# Altium schematic sheet E1811HUB_1.SchDoc
size C
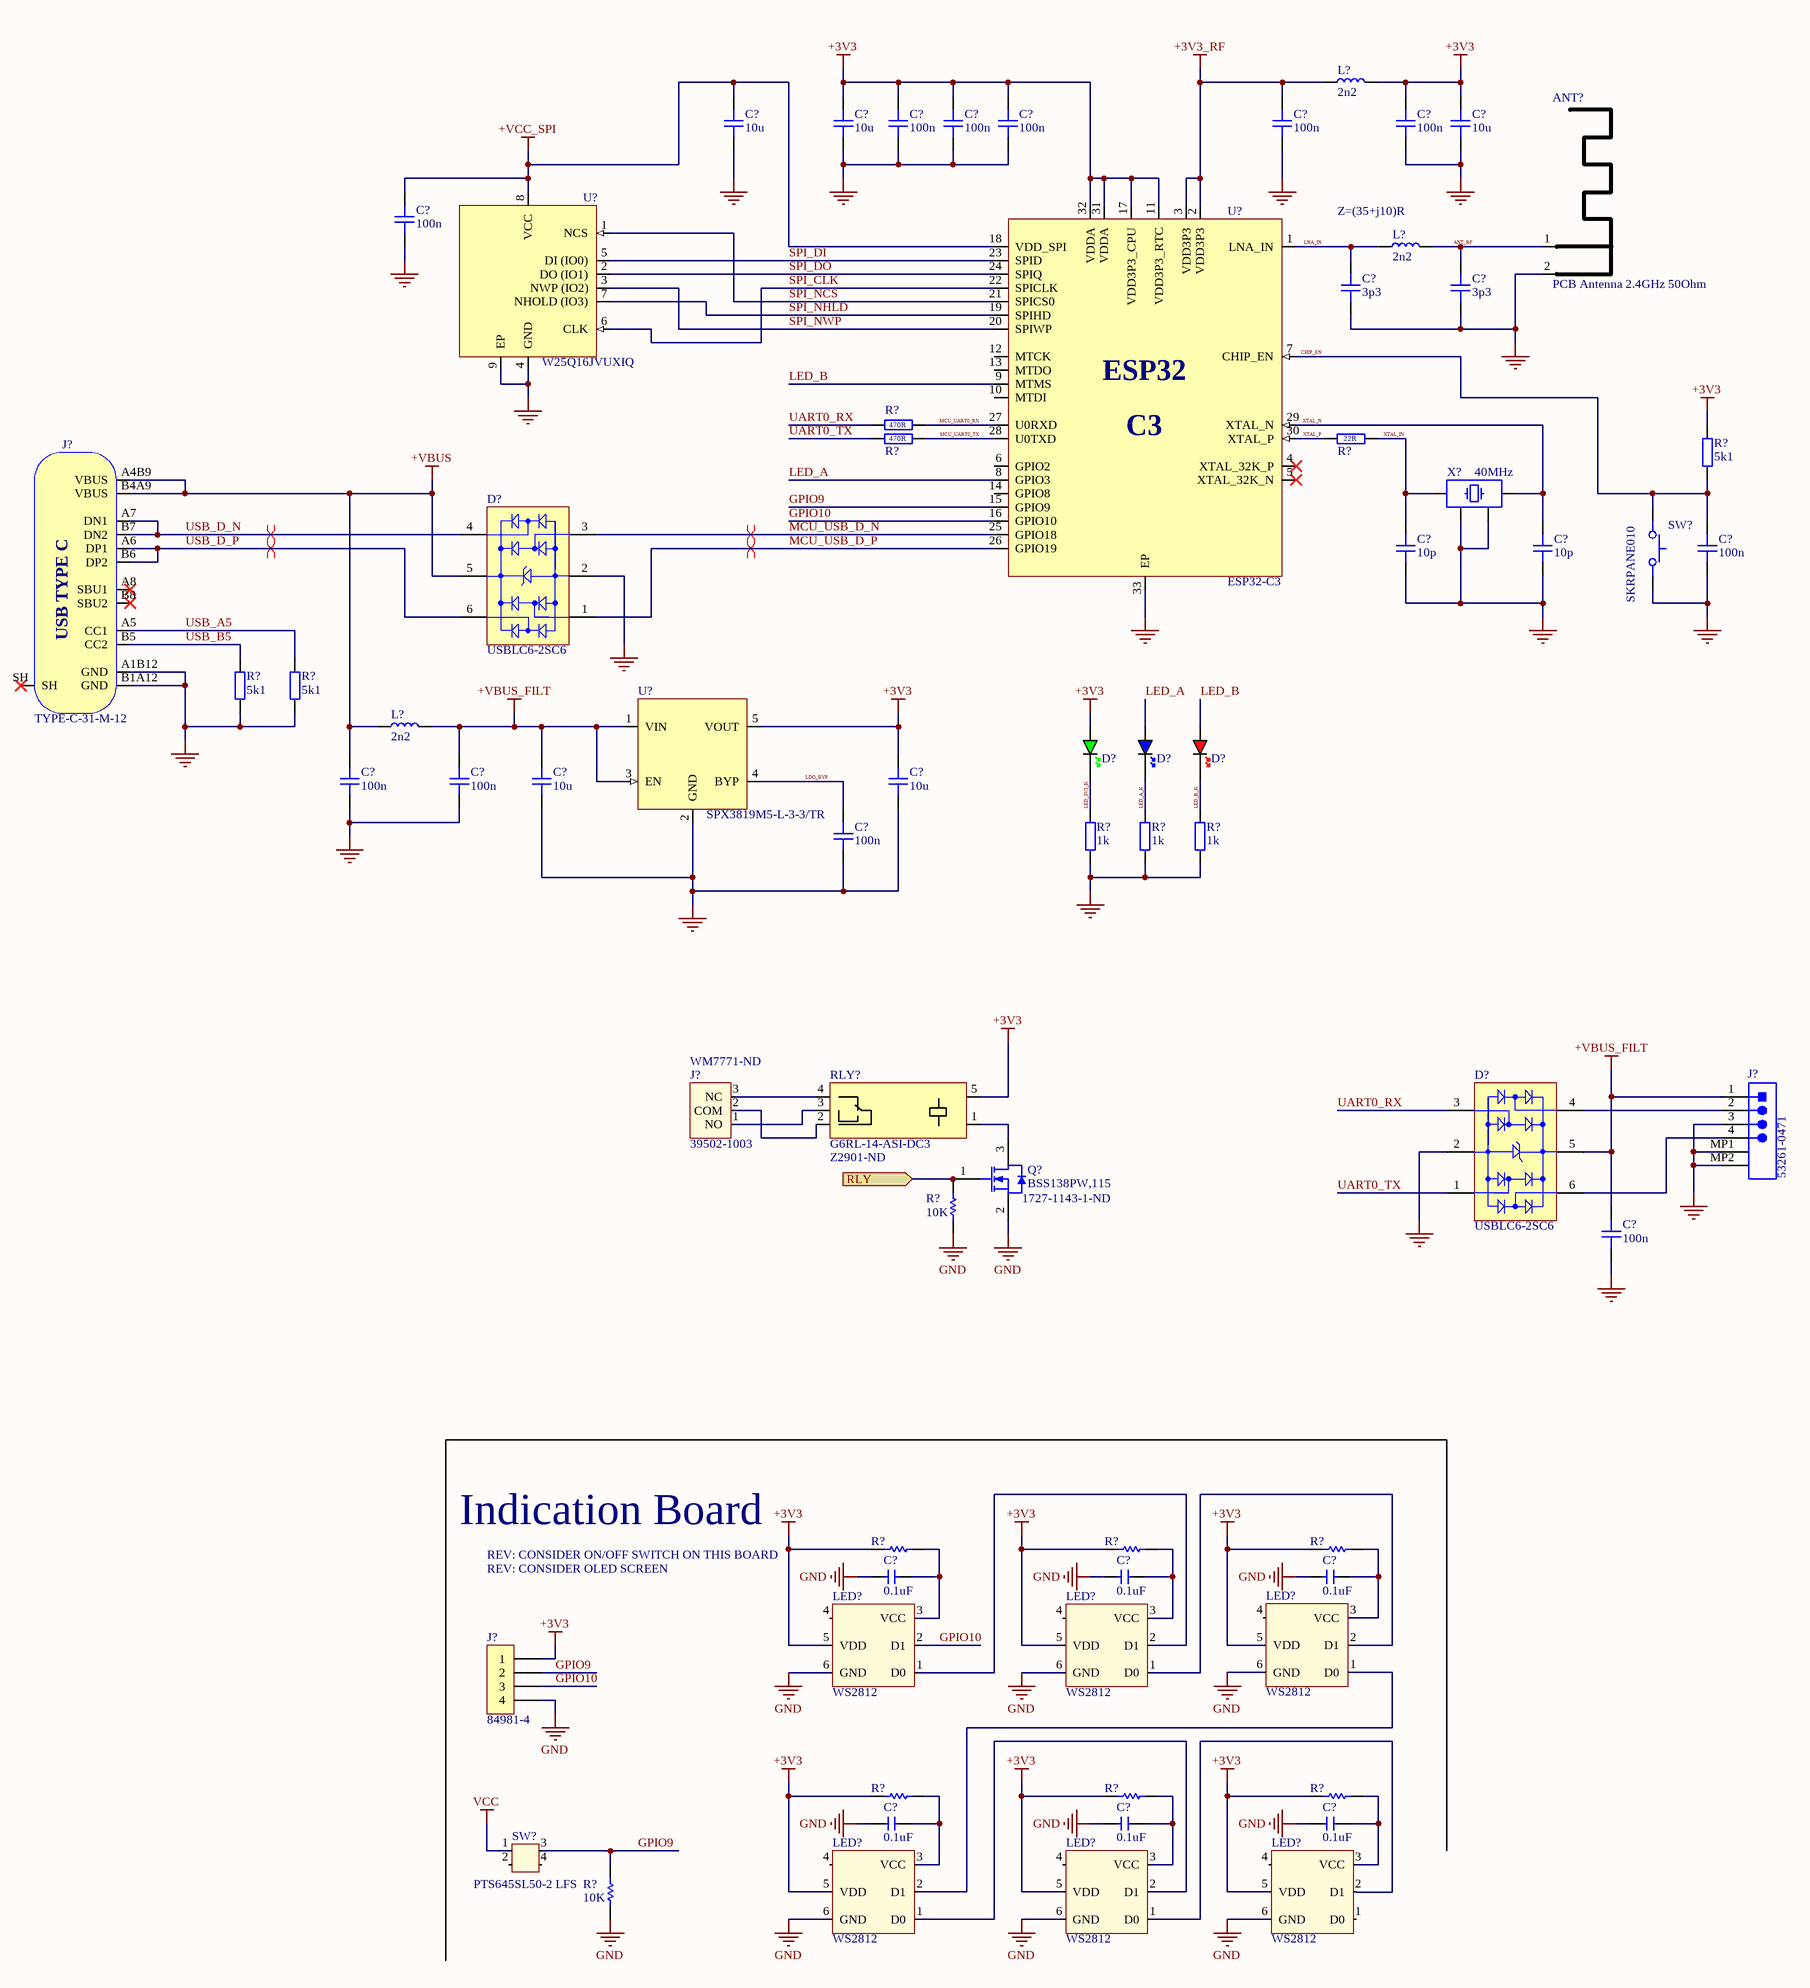
[diagram p0: E1811HUB_1.SchDoc]

## Parts
(Parts that share a designator on the sheet are numbered #1, #2 ... from top to bottom, then left to right.)
ANT?  PCB Antenna 2.4GHz 50Ohm  [ANT_IFA_USB_2_4GHZ_50R]  (no BOM)
C?#1  10u  [CAP_0603]
C?#2  10u  [CAP_0603]
C?#3  100n  [CAP_0402]
C?#4  100n  [CAP_0402]
C?#5  100n  [CAP_0402]
C?#6  100n  [CAP_0402]
C?#7  100n  [CAP_0402]
C?#8  10u  [CAP_0603]
C?#9  100n  [CAP_0402]
C?#10  3p3  [CAP_0402]
C?#11  3p3  [CAP_0402]
C?#12  10p  [CAP_0402]
C?#13  10p  [CAP_0402]
C?#14  100n  [CAP_0402]
C?#15  100n  [CAP_0402]
C?#16  100n  [CAP_0402]
C?#17  10u  [CAP_0603]
C?#18  10u  [CAP_0603]
C?#19  100n  [CAP_0402]
C?#20  100n  [CAP_0402]
C?#21  0.1uF  [CAPC2012N]
C?#22  0.1uF  [CAPC2012N]
C?#23  0.1uF  [CAPC2012N]
C?#24  0.1uF  [CAPC2012N]
C?#25  0.1uF  [CAPC2012N]
C?#26  0.1uF  [CAPC2012N]
D?#1  USBLC6-2SC6  [STM-SOT23-6L_V]
D?#2  GREEN  [LED_0603_GREEN]  (value not drawn)
D?#3  BLUE  [LED_0603_BLUE]  (value not drawn)
D?#4  RED  [LED_0603_RED]  (value not drawn)
D?#5  USBLC6-2SC6  [STM-SOT23-6L_V]
J?#1  TYPE-C-31-M-12  [TYPE-C-31-M-12]
J?#2  53261-0471  [MOLEX-53261-0471_V]
J?#3  39502-1003  Supplier Part Number 1: WM7771-ND  [39502-1003]
J?#4  84981-4  [84981-4]
L?#1  2n2  [IND_0402]
L?#2  2n2  [IND_0402]
L?#3  2n2  [IND_0402]
LED?#1  WS2812  [WS2812]
LED?#2  WS2812  [WS2812]
LED?#3  WS2812  [WS2812]
LED?#4  WS2812  [WS2812]
LED?#5  WS2812  [WS2812]
LED?#6  WS2812  [WS2812]
Q?  BSS138PW,115  Supplier Part Number 1: 1727-1143-1-ND  [NXP-SOT323_M]
R?#1  470R  [RES_0402]
R?#2  470R  [RES_0402]
R?#3  22R  [RES_0402]
R?#4  5k1  [RES_0402]
R?#5  5k1  [RES_0402]
R?#6  5k1  [RES_0402]
R?#7  1k  [RES_0402]
R?#8  1k  [RES_0402]
R?#9  1k  [RES_0402]
R?#10  10K  [RESC2012N]
R?#11  150  [RESC2012N]  (value not drawn)
R?#12  150  [RESC2012N]  (value not drawn)
R?#13  150  [RESC2012N]  (value not drawn)
R?#14  150  [RESC2012N]  (value not drawn)
R?#15  150  [RESC2012N]  (value not drawn)
R?#16  150  [RESC2012N]  (value not drawn)
R?#17  10K  [RESC2012N]
RLY?  G6RL-14-ASI-DC3  Supplier Part Number 1: Z2901-ND  [G6RL-14-ASI-DC3]
SW?#1  SKRPANE010  [SKRPANE010]
SW?#2  PTS645SL50-2 LFS  [PTS645SL50-2 LFS]
U?#1  W25Q16JVUXIQ  [USON-8-2X3MM]
U?#2  ESP32-C3  [QFN32-5x5]
U?#3  SPX3819M5-L-3-3/TR  [SOT-23-5]
X?  40MHz  [XTAL_2520]

## Ports
RLY (in)

## Nets
+3V3: C?#2.2 C?#3.2 C?#4.2 C?#5.2 C?#7.2 C?#8.2 C?#18.2 D?#2.A J?#4.1 L?#1.1 LED?#1.5(VDD) LED?#2.5(VDD) LED?#3.5(VDD) LED?#4.5(VDD) LED?#5.5(VDD) LED?#6.5(VDD) R?#4.2 R?#11.1 R?#12.1 R?#13.1 R?#14.1 R?#15.1 R?#16.1 RLY?.5 U?#2.11(VDD3P3_RTC) U?#2.17(VDD3P3_CPU) U?#2.31(VDDA) U?#2.32(VDDA) U?#3.5(VOUT)
+3V3_RF: C?#6.2 L?#1.2 U?#2.2(VDD3P3) U?#2.3(VDD3P3)
+VBUS: C?#15.2 D?#1.5(VBUS) J?#1.A4B9(VBUS) J?#1.B4A9(VBUS) L?#3.2
+VBUS_FILT: C?#16.2 C?#17.2 C?#20.2 D?#5.5(VBUS) J?#2.1 L?#3.1 U?#3.1(VIN) U?#3.3(EN)
+VCC_SPI: C?#1.2 C?#9.2 U?#1.8(VCC) U?#2.18(VDD_SPI)
GND: ANT?.2(GND) C?#1.1 C?#2.1 C?#3.1 C?#4.1 C?#5.1 C?#6.1 C?#7.1 C?#8.1 C?#9.1 C?#10.1 C?#11.1 C?#12.1 C?#13.1 C?#14.1 C?#15.1 C?#16.1 C?#17.1 C?#18.1 C?#19.1 C?#20.1 C?#21.1 C?#22.1 C?#23.1 C?#24.1 C?#25.1 C?#26.1 D?#1.2(GND) D?#5.2(GND) J?#1.A1B12(GND) J?#1.B1A12(GND) J?#2.3 J?#2.MP1 J?#2.MP2 J?#4.4 LED?#1.6(GND) LED?#2.6(GND) LED?#3.6(GND) LED?#4.6(GND) LED?#5.6(GND) LED?#6.6(GND) Q?.2(S) R?#5.2 R?#6.2 R?#7.1 R?#8.1 R?#9.1 R?#10.1 R?#17.1 SW?#1.12 U?#1.4(GND) U?#1.9(EP) U?#2.33(EP) U?#3.2(GND) X?.2 X?.4
VCC: SW?#2.1
ANT_RF: ANT?.1(RF) C?#11.2 L?#2.1
CHIP_EN: C?#14.2 R?#4.1 SW?#1.34 U?#2.7(CHIP_EN)
GPIO9: J?#4.2 R?#17.2 SW?#2.3 U?#2.15(GPIO9)
GPIO10: J?#4.3 LED?#1.2(D1) U?#2.16(GPIO10)
LDO_BYP: C?#19.2 U?#3.4(BYP)
LED_3V3_K: D?#2.K R?#7.2
LED_A: D?#3.A U?#2.8(GPIO3)
LED_A_K: D?#3.K R?#8.2
LED_B: D?#4.A U?#2.9(MTMS)
LED_B_K: D?#4.K R?#9.2
LNA_IN: C?#10.2 L?#2.2 U?#2.1(LNA_IN)
MCU_UART0_RX: R?#1.2 U?#2.27(U0RXD)
MCU_UART0_TX: R?#2.2 U?#2.28(U0TXD)
MCU_USB_D_N: D?#1.3(I/O_2) U?#2.25(GPIO18)
MCU_USB_D_P: D?#1.1(I/O_1) U?#2.26(GPIO19)
RLY: Q?.1(G) R?#10.2 ; port RLY
SPI_CLK: U?#1.6(CLK) U?#2.22(SPICLK)
SPI_DI: U?#1.5(DI_(IO0)) U?#2.23(SPID)
SPI_DO: U?#1.2(DO_(IO1)) U?#2.24(SPIQ)
SPI_NCS: U?#1.1(NCS) U?#2.21(SPICS0)
SPI_NHLD: U?#1.7(NHOLD_(IO3)) U?#2.19(SPIHD)
SPI_NWP: U?#1.3(NWP_(IO2)) U?#2.20(SPIWP)
UART0_RX: D?#5.3(I/O_2) R?#1.1
UART0_TX: D?#5.1(I/O_1) R?#2.1
USB_A5: J?#1.A5(CC1) R?#6.1
USB_B5: J?#1.B5(CC2) R?#5.1
USB_D_N: D?#1.4(I/O_3) J?#1.A7(DN1) J?#1.B7(DN2)
USB_D_P: D?#1.6(I/O_4) J?#1.A6(DP1) J?#1.B6(DP2)
XTAL_IN: C?#12.2 R?#3.2 X?.3
XTAL_N: C?#13.2 U?#2.29(XTAL_N) X?.1
XTAL_P: R?#3.1 U?#2.30(XTAL_P)
NetC?#21_2: C?#21.2 LED?#1.3(VCC) R?#11.2
NetC?#22_2: C?#22.2 LED?#2.3(VCC) R?#12.2
NetC?#23_2: C?#23.2 LED?#3.3(VCC) R?#13.2
NetC?#24_2: C?#24.2 LED?#4.3(VCC) R?#14.2
NetC?#25_2: C?#25.2 LED?#5.3(VCC) R?#15.2
NetC?#26_2: C?#26.2 LED?#6.3(VCC) R?#16.2
NetD?#5_4: D?#5.4(I/O_3) J?#2.2
NetD?#5_6: D?#5.6(I/O_4) J?#2.4
NetJ?#3_1: J?#3.1(NO) RLY?.3
NetJ?#3_2: J?#3.2(COM) RLY?.2
NetJ?#3_3: J?#3.3(NC) RLY?.4
NetLED?#1_1: LED?#1.1(D0) LED?#2.2(D1)
NetLED?#2_1: LED?#2.1(D0) LED?#3.2(D1)
NetLED?#3_1: LED?#3.1(D0) LED?#4.2(D1)
NetLED?#4_1: LED?#4.1(D0) LED?#5.2(D1)
NetLED?#5_1: LED?#5.1(D0) LED?#6.2(D1)
NetQ?_3: Q?.3(D) RLY?.1

Not connected (* = marked no-connect by the designer): J?#1 A8(SBU1)* B8(SBU2)* SH*; LED?#1 4(_); LED?#2 4(_); LED?#3 4(_); LED?#4 4(_); LED?#5 4(_); LED?#6 1(D0) 4(_); SW?#2 2 4; U?#2 4(XTAL_32K_P)* 5(XTAL_32K_N)* 6(GPIO2) 10(MTDI) 12(MTCK) 13(MTDO) 14(GPIO8)

## Layout directives
differential pair; differential pair class DIFF_USB: MCU_USB_D_N, MCU_USB_D_P, USB_D_N, USB_D_P

## Notes on the sheet
- (near L?#2) Z=(35+j10)R
- Indication Board
- REV: CONSIDER ON/OFF SWITCH ON THIS BOARD
- REV: CONSIDER OLED SCREEN
- (in symbol ESP32-C3) ESP32; C3
- (in symbol TYPE-C-31-M-12) USB TYPE C

## Library data of the parts
ANT? = ANT_IFA_USB_2_4GHZ_50R: Inverted F 2.4GHz ISM PCB Antenna 50 Ohm; ComponentLink1Description: Datasheet; ComponentLink1URL: https://www.ti.com/lit/an/swra117d/swra117d.pdf
C?#1 C?#2 C?#8 C?#17 C?#18 = CAP_0603_10V: Capacitor SMD 0603 10V; Manufacturer: Samsung; Manufacturer Part Number: CL10A106KP8NNNC; LCSC: C19702
C?#3-C?#7 C?#9 C?#14-C?#16 C?#19 C?#20 = CAP_0402_50V: Capacitor SMD 0402 50V; Manufacturer: Samsung; Manufacturer Part Number: CL05B104KO5NNNC; LCSC: C1525
C?#10 C?#11 = CAP_0402_50V: Capacitor SMD 0402 50V; Manufacturer: FH; Manufacturer Part Number: 0402CG3R3C500NT; LCSC: C1565
C?#12 C?#13 = CAP_0402_50V: Capacitor SMD 0402 50V; Manufacturer: Samsung; Manufacturer Part Number: CL05C100JB5NNNC; LCSC: C32949
C?#21-C?#26 = Cap_0.1uF_50V_0805: CAP CER 0.1UF 50V; Manufacturer: KEMET; Manufacturer P/N: C0805C104M5RACAUTO; Dielectric Material: Ceramic; Tolerance: 20%; Dielectric: X7R; Capacitance: 100nF; Supplier 1: Digi-Key; Supplier Part Number 1: 399-12977-1-ND; Mount: Surface Mount; Case/Package: 0805; Case Code (Metric): 2012; Case Code (Imperial): 0805; Contact Plating: Matte,Tin; Min Operating Temperature: -55°C; Max Operating Temperature: 125°C; Voltage Rating: 50V; Voltage Rating (DC): 50V; Termination: Wraparound; Length: 2mm; Width: 0.049inch; Thickness: 0.035inch; Depth: 1.25mm; Ratings: AEC-Q200; REACH SVHC: No SVHC
D?#1 D?#5 = CMP-2000-05378-1: Very low capacitance ESD protection, 3.5 pF, -40 to 125 degC, 6-Pin SOT23, RoHS, Tape and Reel; Manufacturer: STMicroelectronics; Polarity: Uni-Directional; Clamping Voltage: 17V; Rad Hardened: No; Product Height (mm): 1.3mm; Leakage Current (Max): 0.15uA; Product Length (mm): 3.05mm; Number of Elements: 1; Peak Pulse Current: 5A; Configuration: Dual; Reverse Breakdown Voltage: 6V; Working Voltage (Max): 5V; Capacitance Value: 3.5pF; Suppressor Type: DiodeArrays; Product Depth (mm): 1.75mm; Test Current (It): 1mA; Package / Case: SOT-23; Operating Temperature Max Deg. C: 125C; Package Description: 6-Pin Small Outline Transistor, Body 2.925 x 1.625 mm, Pitch 0.95 mm; Package Reference: SOT23-6L; Datasheet Version: Rev. 5, 10/2011; Operating Temperature Min Deg. C: -40C; Mounting Style: SurfaceMount; Direction Type: Uni-Directional; Mounting: SurfaceMount; Pin Count: 6; Leakage Current: 0.15uA; Packaging: TapeandReel; Operating Temperature Classification: Automotive; Clamping Voltage (Max): 17V; Manufacturer URL: http://www.st.com/; Reverse Stand-off Voltage: 5V; Datasheet URL: http://www.st.com/st-web-ui/static/active/en/resource/technical/document/datasheet/CD00050750.pdf; Working Voltage: 5V; Operating Temp Range: -40Cto125C; LCSC: C7519
D?#2 = LED_0603_GREEN: LED 0603 GREEN SMD; LCSC: C72043
D?#3 = LED_0603_BLUE: LED 0603 BLUE SMD
D?#4 = LED_0603_RED: LED 0603 RED SMD
J?#1 = TYPE-C-31-M-12: USB Type C Connector Horizontal SMT; Manufacturer: Koren Hroparts; Manufacturer Part Number: TYPE-C-31-M-12; LCSC: C165948
J?#2 = CMP-2000-05238-1: Male Header, Pitch 1.25 mm, 1 x 4 Position, Height 3.4 mm, -40 to 85 degC, RoHS, Tape and Reel; Current Rating: 1A; Brand: Molex; Number of Positions / Contacts: 4; Pitch: 1.25mm; Voltage Rating: 125V; Mounting Angle: Right; Manufacturer URL: http://www.molex.com/; Factory Pack Quantity: 1000; Housing Material: Thermoplastic; Datasheet URL: http://www.molex.com/pdm_docs/sd/532610471_sd.pdf; Tradename: PicoBlade; Product Type: Headers; Contact Plating: Tin; Contact Material: PhosphorBronze; Package Description: 1.25mm Pitch PicoBlade(TM) Header, Surface Mount, Right Angle, Lead-Free, 4 Circuits; Mounting Style: SMD/SMT; Manufacturer: Molex; Series: 53261; Packaging: Reel; Number of Rows: 1; RoHS: Details; Number of Positions: 4; Product Category: Headers&WireHousings; Datasheet Version: Rev. G, 01/2012; Type: Shrouded; Termination Style: SMD; LCSC: C240847
J?#3 = 39502-1003: TERM BLOCK HDR 3POS 90DEG 3.5MM; Manufacturer: Molex; Manufacturer Part Number: 0395021003; Contact Resistance: 8mR; Current Rating: 8A; Voltage Rating: 300V; Number of Positions: 3; Number of Levels: 1; Supplier 1: Digi-Key; RoHS: Yes; Category: Headers and Wire Housings; Stock 1: 1366; Pricing 1: 1=0.78000, 10=0.64800, 100=0.54000, 1000=0.43200, 5000=0.37800, 10000=0.35910 (USD); Mount: Through Hole; Contact Plating: Tin; Color: Black; Housing Color: Black; Contact Material: Brass; Housing Material: Polyamide; Min Operating Temperature: -40°C; Max Operating Temperature: 105°C; Number of Rows: 1; Package Quantity: 1280; Packaging: Bulk; Termination: Solder; Number of Contacts: 3; Orientation: Right Angle; Number of Circuits: 3; Series: Eurostyle™ ESE 39502; Number of Positions Per Level: 3; Current: 8A; Voltage: 300V; Length: 11.89mm; Width: 9.2mm; Pitch: 3.5mm; Depth: 9.2mm; REACH SVHC: No SVHC; Halogen Free: Low Halogen; ELV: Compliant; Lead Free: Lead Free; Flammability Rating: UL94 V-0; RoHS Compliant: Yes; ComponentLink1URL: http://www.onlinecomponents.com/datasheet/395021003.aspx?p=17943918&src-supplier=Onlinecomponents.com; ComponentLink1Description: http://www.onlinecomponents.com/datasheet/395021003.aspx?p=17943918&src-supplier=Onlinecomponents.com; ComponentLink2URL: http://components.arrow.com/part/dataview/0323_01936340?src-supplier=Arrow+Europe; ComponentLink2Description: http://components.arrow.com/part/dataview/0323_01936340?src-supplier=Arrow+Europe; ComponentLink3URL: http://www.molex.com/webdocs/datasheets/pdf/en-us/0395021003_TERMINAL_BLOCKS.pdf?src-supplier=Avnet; ComponentLink3Description: http://www.molex.com/webdocs/datasheets/pdf/en-us/0395021003_TERMINAL_BLOCKS.pdf?src-supplier=Avnet; ComponentLink4URL: https://www.molex.com/pdm_docs/sd/395021002_sd.pdf?src-supplier=Digi-Key; ComponentLink4Description: https://www.molex.com/pdm_docs/sd/395021002_sd.pdf?src-supplier=Digi-Key; ComponentLink5URL: http://components.arrow.com/part/dataview/44158187S8420486N3303?src-supplier=Arrow+Electronics; ComponentLink5Description: http://components.arrow.com/part/dataview/44158187S8420486N3303?src-supplier=Arrow+Electronics
L?#1-L?#3 = IND_0402: Inductor SMD 0402; Manufacturer: Murata; Manufacturer Part Number: LQW15AN2N2G80D; LCSC: C412264
Q? = CMP-1259-00109-1: N-Channel Trench MOSFET, 60 V, 0.32 A, -55 to 150 degC, 3-Pin SOT323, Tape and Reel; Manufacturer: NXP Semiconductors; Manufacturer Part Number: BSS138PW,115""; IDM [max] (A): 1.2; ID [max] (A): 0.32; Automotive Qualified: Y; Channel Type: N; VDS [max] (V): 60; Packing: Tape & Reel; Rise Time: 3ns; Continuous Drain Current (ID): 320mA; Turn-On Delay Time: 2ns; Turn-Off Delay Time: 9ns; Fall Time: 4ns; Gate to Source Voltage (Vgs): 20V; Rds On Max: 1.6R; Input Capacitance: 50pF; Max Dual Supply Voltage: 60V; Power Dissipation: 260mW; Number of Elements: 1; DatasheetVersion: Rev. 1; PartNumber: BSS138PW,115; ComponentLink2URL: http://www.nxp.com/documents/data_sheet/BSS138PW.pdf; ComponentLink3Description: Package Specification; PackageReference: SOT323; PackageDescription: 3-Pin Small Outline Transistor Package, Body 2 x 1.25 mm, Pitch 0.65 mm; Code_JEITA: SC-70; ComponentLink3URL: http://www.nxp.com/documents/outline_drawing/sot323_po.pdf; ComponentLink1URL: http://www.nxp.com/; ComponentLink2Description: Datasheet; PackageVersion: 06-03-16, 03/2006; Mounting Technology: Surface Mount; ComponentLink1Description: Manufacturer URL; VGSth [typ] (V): 1.2; Supplier 1: Digi-Key; RoHS: Yes; Category: MOSFETs; Stock 1: 503503; Pricing 1: 1=0.210000, 10=0.146000, 100=0.071100, 500=0.059280, 1000=0.041180 (USD); Case/Package: SOT; Number of Pins: 3; Contact Plating: Tin; Min Operating Temperature: -55°C; Max Operating Temperature: 150°C; Package Quantity: 3000; Packaging: Tape and Reel; Drain to Source Voltage (Vdss): 60V; Drain to Source Breakdown Voltage: 60V; Drain to Source Resistance: 1.6R; Max Power Dissipation: 260mW; Radiation Hardening: No; Lead Free: Lead Free; ComponentLink4URL: https://datasheet.ciiva.com/6371/bss138pw-6371075.pdf?src-supplier=Digi-Key; ComponentLink4Description: https://datasheet.ciiva.com/6371/bss138pw-6371075.pdf?src-supplier=Digi-Key; ComponentLink5URL: https://datasheet.ciiva.com/18567/bss138pw-18567014.pdf?src-supplier=Digi-Key; ComponentLink5Description: https://datasheet.ciiva.com/18567/bss138pw-18567014.pdf?src-supplier=Digi-Key; ComponentLink6URL: https://datasheet.ciiva.com/18567/bss138pw-18567015.pdf?src-supplier=Digi-Key; ComponentLink6Description: https://datasheet.ciiva.com/18567/bss138pw-18567015.pdf?src-supplier=Digi-Key; ComponentLink7URL: https://datasheet.ciiva.com/18567/bss138pw-18567016.pdf?src-supplier=Digi-Key; ComponentLink7Description: https://datasheet.ciiva.com/18567/bss138pw-18567016.pdf?src-supplier=Digi-Key; ComponentLink8URL: https://datasheet.ciiva.com/1255/bss138pw-1255034.pdf?src-supplier=Newark; ComponentLink8Description: https://datasheet.ciiva.com/1255/bss138pw-1255034.pdf?src-supplier=Newark
R?#1 R?#2 R?#7-R?#9 = RES_0402: Resistor SMD 0402; Manufacturer: UNI-ROYAL; Manufacturer Part Number: 0402WGF4700TCE; LCSC: C25117
R?#3 = RES_0402: Resistor SMD 0402; Manufacturer: UNI-ROYAL; Manufacturer Part Number: 0402WGF220JTCE; LCSC: C25092
R?#4-R?#6 = RES_0402: Resistor SMD 0402; Manufacturer: YAGEO; Manufacturer Part Number: RC0402JR-075K1L; LCSC: C105873
R?#10 R?#17 = Res_10K_0805: RES 10K OHM 1/8W 1% 0805; Manufacturer: Vishay; Manufacturer P/N: CRCW080510K0FKEA; Resistance: 10kR; Power Rating: 125mW; Voltage Rating: 150V; Temperature Coefficient: 100ppm/°C; Supplier 1: Digi-Key; Supplier Part Number 1: 541-10.0KCCT-ND; Case/Package: 0805; Weight: 0.000194oz; Case Code (Imperial): 0805; Case Code (Metric): 2012; Contact Plating: Tin; Min Operating Temperature: -55°C; Max Operating Temperature: 155°C; Tolerance: 1%; Package Quantity: 5000; Composition: Thick Film; Military Standard: Not; Termination: SMD/SMT; Voltage Rating (DC): 150V; Length: 2mm; Height: 0.45mm; Width: 1.25mm; Depth: 1.25mm; Radiation Hardening: No; REACH SVHC: Unknown; Lead Free: Lead Free; ComponentLink4URL: http://www.vishay.com/docs/20035/dcrcwe3.pdf; ComponentLink4Description: http://www.vishay.com/docs/20035/dcrcwe3.pdf
R?#11-R?#16 = Res_150_0805: RES 150 OHM 1/8W 1% 0805; Manufacturer: Vishay; Manufacturer P/N: CRCW0805150RFKEA; Power Rating: 125mW; Resistance: 150R; Voltage Rating: 150V; Temperature Coefficient: 100ppm/°C; Supplier 1: Digi-Key; Supplier Part Number 1: 541-150CCT-ND; Mount: Surface Mount; Case/Package: 0805; Weight: 0.000194oz; Case Code (Metric): 2012; Case Code (Imperial): 0805; Contact Plating: Tin; Min Operating Temperature: -55°C; Max Operating Temperature: 155°C; Tolerance: 1%; Package Quantity: 10; Composition: Thick Film; Termination: SMD/SMT; Max Power Dissipation: 125mW; Voltage Rating (DC): 150V; Features: Automotive AEC-Q200; Military Standard: Not; Length: 2mm; Height: 0.45mm; Width: 0.049inch; Depth: 1.25mm; Radiation Hardening: No; Lead Free: Lead Free; REACH SVHC: Unknown; ComponentLink3URL: http://www.vishay.com/docs/20035/dcrcwe3.pdf; ComponentLink3Description: http://www.vishay.com/docs/20035/dcrcwe3.pdf
RLY? = G6RL-14-ASI-DC3: RELAY GENERAL PURPOSE SPDT 8A 3V; Manufacturer: Omron; Coil Current: 73.3mA; Max Voltage Rating (DC): 300V; Operate Time: 10ms; Release Time: 5ms; Max Voltage Rating (AC): 400V; Coil Power: 220mW; Coil Resistance: 40R; Coil Type: Non-Latching; Supplier 1: Digi-Key; Manufacturer Part Number: G6RL-14-ASI-DC3; RoHS: Yes; Category: Power Relays; Stock 1: 2855; Pricing 1: 1=3.90000, 10=3.65200, 25=3.24600, 50=3.08380, 100=2.92140, 250=2.59680, 500=2.43450, 1000=2.27220, 5000=2.19105 (USD); Mount: Through Hole; Number of Pins: 5; Contact Material: Tin,Silver; Weight: 7.8g; Min Operating Temperature: -40°C; Max Operating Temperature: 85°C; Package Quantity: 100; Packaging: Bulk; Throw Configuration: SPDT; Contact Current Rating: 8A; Termination: PC Pin; Relay Type: General Purpose; Coil Voltage (DC): 3V; Radiation Hardening: No; ComponentLink1URL: https://datasheet.ciiva.com/8687/g6rl-0911-8687382.pdf?src-supplier=Avnet; ComponentLink1Description: https://datasheet.ciiva.com/8687/g6rl-0911-8687382.pdf?src-supplier=Avnet; ComponentLink2URL: https://datasheet.ciiva.com/2407/g6rl-0911-2407665.pdf?src-supplier=Digi-Key; ComponentLink2Description: https://datasheet.ciiva.com/2407/g6rl-0911-2407665.pdf?src-supplier=Digi-Key
SW?#1 = SKRPANE010: Tactile Switch SMD SPST; Manufacturer: Alps Alpine; Manufacturer Part Number: SKRPANE010; LCSC: C470426
U?#1 = W25Q16JVUXIQ: 16M-BIT SERIAL FLASH MEMORY WITH / DUAL/QUAD SPI USON-8; Manufacturer: Winbond; Manufacturer Part Number: W25Q16JVUXIQ; LCSC: C2843335
U?#2 = ESP32-C3: Ultra­Low­Power SoC with RISC­V Single­Core CPU Supporting IEEE 802.11b/g/n (2.4 GHz Wi­Fi) and Bluetooth® 5 (LE); Manufacturer: Espressif; Manufacturer Part Number: ESP32-C3; LCSC: C2838500
U?#3 = SPX3819M5-L-3-3/TR: 500mA +3.3V Low-Noise LDO Voltage Regulator; Manufacturer: MaxLinear; Manufacturer Part Number: SPX3819M5-L-3-3/TR; LCSC: C9055
X? = XTAL_2520: Crystal SMD 2520; Manufacturer: Seiko Epson; Manufacturer Number: Q24FA20H0020900; Frequency: 40MHz; LCSC: C255973
J?#4 = 84981-4: Supplier 1: Digi-Key; Supplier Part Number 1: A101369CT-ND